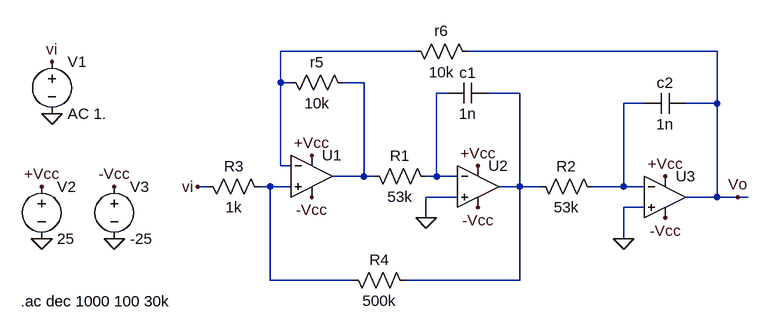
[diagram p0: schematic KHN_filter_old.asc]
KHN_filter_old.asc, the LTspice schematic file:
Version 4
SHEET 1 1092 680
WIRE 256 -112 48 -112
WIRE 720 -112 336 -112
WIRE 48 -64 48 -112
WIRE 64 -64 48 -64
WIRE 176 -64 144 -64
WIRE 304 -48 288 -48
WIRE 416 -48 368 -48
WIRE 608 -32 576 -32
WIRE 720 -32 720 -112
WIRE 720 -32 672 -32
WIRE 48 64 48 -64
WIRE 64 64 48 64
WIRE 176 80 176 -64
WIRE 176 80 128 80
WIRE 192 80 176 80
WIRE 288 80 288 -48
WIRE 288 80 272 80
WIRE 320 80 288 80
WIRE -64 96 -80 96
WIRE 32 96 16 96
WIRE 64 96 32 96
WIRE 416 96 416 -48
WIRE 416 96 384 96
WIRE 448 96 416 96
WIRE 576 96 576 -32
WIRE 576 96 528 96
WIRE 608 96 576 96
WIRE 320 112 272 112
WIRE 720 112 720 -32
WIRE 720 112 672 112
WIRE 752 112 720 112
WIRE 768 112 752 112
WIRE 608 128 576 128
WIRE 272 144 272 112
WIRE 576 176 576 128
WIRE 32 240 32 96
WIRE 160 240 32 240
WIRE 416 240 416 96
WIRE 416 240 240 240
FLAG 272 144 0
FLAG 576 176 0
FLAG -320 176 0
FLAG -208 176 0
FLAG -320 96 +Vcc
FLAG 96 48 +Vcc
FLAG 352 64 +Vcc
FLAG 640 80 +Vcc
FLAG -208 96 -Vcc
FLAG 96 112 -Vcc
FLAG 352 128 -Vcc
FLAG 640 144 -Vcc
FLAG -304 -16 0
FLAG -80 96 vi
FLAG -304 -96 vi
FLAG 752 112 Vo
SYMBOL res -80 80 M90
WINDOW 0 0 56 VBottom 2
WINDOW 3 32 56 VTop 2
SYMATTR InstName R3
SYMATTR Value 1k
SYMBOL res 48 -80 M90
WINDOW 0 0 56 VBottom 2
WINDOW 3 32 56 VTop 2
SYMATTR InstName r5
SYMATTR Value 10k
SYMBOL res 176 64 M90
WINDOW 0 0 56 VBottom 2
WINDOW 3 32 56 VTop 2
SYMATTR InstName R1
SYMATTR Value 53k
SYMBOL cap 368 -64 R90
WINDOW 0 0 32 VBottom 2
WINDOW 3 32 32 VTop 2
SYMATTR InstName c1
SYMATTR Value 1n
SYMBOL res 432 80 M90
WINDOW 0 0 56 VBottom 2
WINDOW 3 32 56 VTop 2
SYMATTR InstName R2
SYMATTR Value 53k
SYMBOL cap 672 -48 R90
WINDOW 0 0 32 VBottom 2
WINDOW 3 32 32 VTop 2
SYMATTR InstName c2
SYMATTR Value 1n
SYMBOL res 144 224 M90
WINDOW 0 0 56 VBottom 2
WINDOW 3 32 56 VTop 2
SYMATTR InstName R4
SYMATTR Value 500k
SYMBOL res 240 -128 M90
WINDOW 0 0 56 VBottom 2
WINDOW 3 32 56 VTop 2
SYMATTR InstName r6
SYMATTR Value 10k
SYMBOL voltage -320 80 R0
WINDOW 123 0 0 Left 0
WINDOW 39 0 0 Left 0
SYMATTR InstName V2
SYMATTR Value 25
SYMBOL voltage -208 80 R0
WINDOW 123 0 0 Left 0
WINDOW 39 0 0 Left 0
SYMATTR InstName V3
SYMATTR Value -25
SYMBOL OpAmps\\UniversalOpAmp2 96 80 R0
SYMATTR InstName U1
SYMBOL OpAmps\\UniversalOpAmp2 352 96 R0
SYMATTR InstName U2
SYMBOL OpAmps\\UniversalOpAmp2 640 112 R0
SYMATTR InstName U3
SYMBOL voltage -304 -112 R0
WINDOW 123 0 0 Left 0
WINDOW 39 0 0 Left 0
SYMATTR InstName V1
SYMATTR Value AC 1.
TEXT -352 272 Left 2 !.ac dec 1000 100 30k

The netlist it stands for:
* KHN_filter_old.asc
R3 vi N006 1k
r5 N001 N002 10k
R1 N002 N003 53k
c1 N004 N003 1n
R2 N004 N005 53k
c2 Vo N005 1n
R4 N006 N004 500k
r6 N001 Vo 10k
V2 +Vcc 0 25
V3 -Vcc 0 -25
XU1 N006 N001 +Vcc -Vcc N002 level2 Avol=1Meg GBW=10Meg Slew=10Meg Ilimit=25m Rail=0 Vos=0 En=0 Enk=0 In=0 Ink=0 Rin=500Meg  ; pins In+ In- V+ V- OUT
XU2 0 N003 +Vcc -Vcc N004 level2 Avol=1Meg GBW=10Meg Slew=10Meg Ilimit=25m Rail=0 Vos=0 En=0 Enk=0 In=0 Ink=0 Rin=500Meg  ; pins In+ In- V+ V- OUT
XU3 0 N005 +Vcc -Vcc Vo level2 Avol=1Meg GBW=10Meg Slew=10Meg Ilimit=25m Rail=0 Vos=0 En=0 Enk=0 In=0 Ink=0 Rin=500Meg  ; pins In+ In- V+ V- OUT
V1 vi 0 AC 1.
.ac dec 1000 100 30k
.lib UniversalOpAmp2.lib
.backanno
.end